# Altium schematic sheet Sheet1.SchDoc
size A4
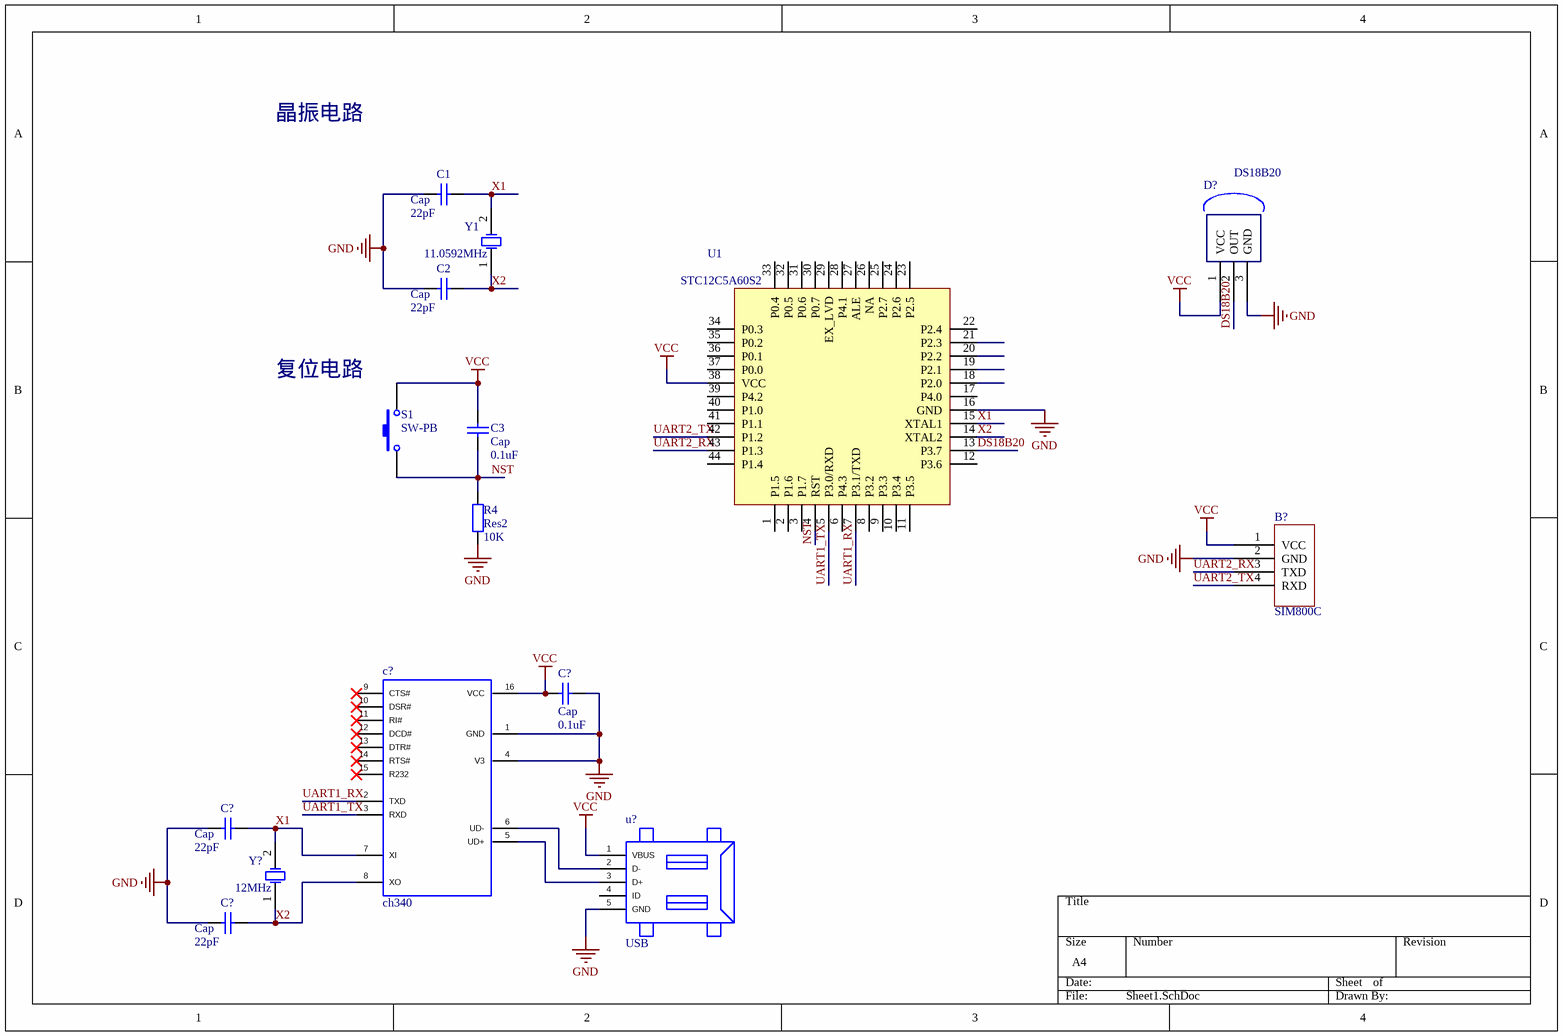
[diagram p0: Sheet1.SchDoc]

## Parts
(Parts that share a designator on the sheet are numbered #1, #2 ... from top to bottom, then left to right.)
B?  SIM800C
C1  Cap  value 22pF  [RAD-0.3]
C2  Cap  value 22pF  [RAD-0.3]
C3  Cap  value 0.1uF  [RAD-0.3]
C?#1  Cap  value 0.1uF  [RAD-0.3]
c?#2  ch340
C?#3  Cap  value 22pF  [RAD-0.3]
C?#4  Cap  value 22pF  [RAD-0.3]
D?  DS18B20
R4  Res2  value 10K  [AXIAL-0.4]
S1  SW-PB  [SPST-2]
U1  STC12C5A60S2  [TQFP-44]
u?  USB
Y1  11.0592MHz  [R38]
Y?  12MHz  [R38]

## Nets
GND: B?.2(GND) C1.1 C2.1 C?#1.1 c?#2.1(GND) c?#2.4(V3) C?#3.1 C?#4.1 D?.3(GND) R4.1 U1.16(GND) u?.5(GND)
VCC: B?.1(VCC) C3.2 C?#1.2 c?#2.16(VCC) D?.1(VCC) S1.2 U1.38(VCC) u?.1(VBUS)
DS18B20: D?.2(OUT) U1.13(P3.7)
NST: C3.1 R4.2 S1.1 U1.4(RST)
UART1_RX: c?#2.2(TXD) U1.7(P3.1/TXD)
UART1_TX: c?#2.3(RXD) U1.5(P3.0/RXD)
UART2_RX: B?.3(TXD) U1.43(P1.3)
UART2_TX: B?.4(RXD) U1.42(P1.2)
X1: C1.2 c?#2.7(XI) C?#3.2 U1.15(XTAL1) Y1.2(OSC2) Y?.2(OSC2)
X2: C2.2 c?#2.8(XO) C?#4.2 U1.14(XTAL2) Y1.1(OSC1) Y?.1(OSC1)
Netc?#2_5: c?#2.5(UD+) u?.3(D+)
Netc?#2_6: c?#2.6(UD-) u?.2(D-)

Not connected (* = marked no-connect by the designer): c?#2 9(CTS#)* 10(DSR#)* 11(RI#)* 12(DCD#)* 13(DTR#)* 14(RTS#)* 15(R232)*; U1 1(P1.5) 2(P1.6) 3(P1.7) 6(P4.3) 8(P3.2) 9(P3.3) 10(P3.4) 11(P3.5) 12(P3.6) 17(P4.0) 18(P2.0) 19(P2.1) 20(P2.2) 21(P2.3) 22(P2.4) 23(P2.5) 24(P2.6) 25(P2.7) 26(NA) 27(ALE) 28(P4.1) 29(EX_LVD) 30(P0.7) 31(P0.6) 32(P0.5) 33(P0.4) 34(P0.3) 35(P0.2) 36(P0.1) 37(P0.0) 39(P4.2) 40(P1.0) 41(P1.1) 44(P1.4); u? 4(ID)

## Notes on the sheet
- 晶振电路
- 复位电路

## Library data of the parts
B? = BT06
C1-C3 C?#1 C?#3 C?#4 = Cap: Capacitor; Published: 8-Jun-2000; LatestRevisionDate: 17-Jul-2002; LatestRevisionNote: Re-released for DXP Platform.; PackageReference: RAD-0.3; Publisher: Altium Limited; PackageDescription: Radial Cap, Thru-Hole; 2 Leads; 0.3 in Pin Spacing
R4 = Res2: Resistor; Published: 8-Jun-2000; LatestRevisionDate: 17-Jul-2002; LatestRevisionNote: Re-released for DXP Platform.; PackageReference: AXIAL-0.4; Publisher: Altium Limited; PackageDescription: Axial Device, Thru-Hole; 2 Leads; 0.4 in Pin Spacing
S1 = SW-PB: Switch; Published: 24-Mar-1999; LatestRevisionDate: 17-Jul-2002; LatestRevisionNote: Re-released for DXP Platform.; PackageReference: SPST-2; Publisher: Altium Limited; PackageDescription: Switch; 2 Leads
Y1 Y? = XTAL: Crystal Oscillator; Published: 8-Jun-2000; LatestRevisionDate: 17-Jul-2002; LatestRevisionNote: Re-released for DXP Platform.; PackageReference: R38; Publisher: Altium Limited; PackageDescription: Crystal, Thru-Hole; 2 Leads; Body 3.1 x 8.2 mm (Dia.xH)